# Altium schematic sheet RobotHead.SchDoc
size A4; SheetNumber: 1; SheetTotal: 1
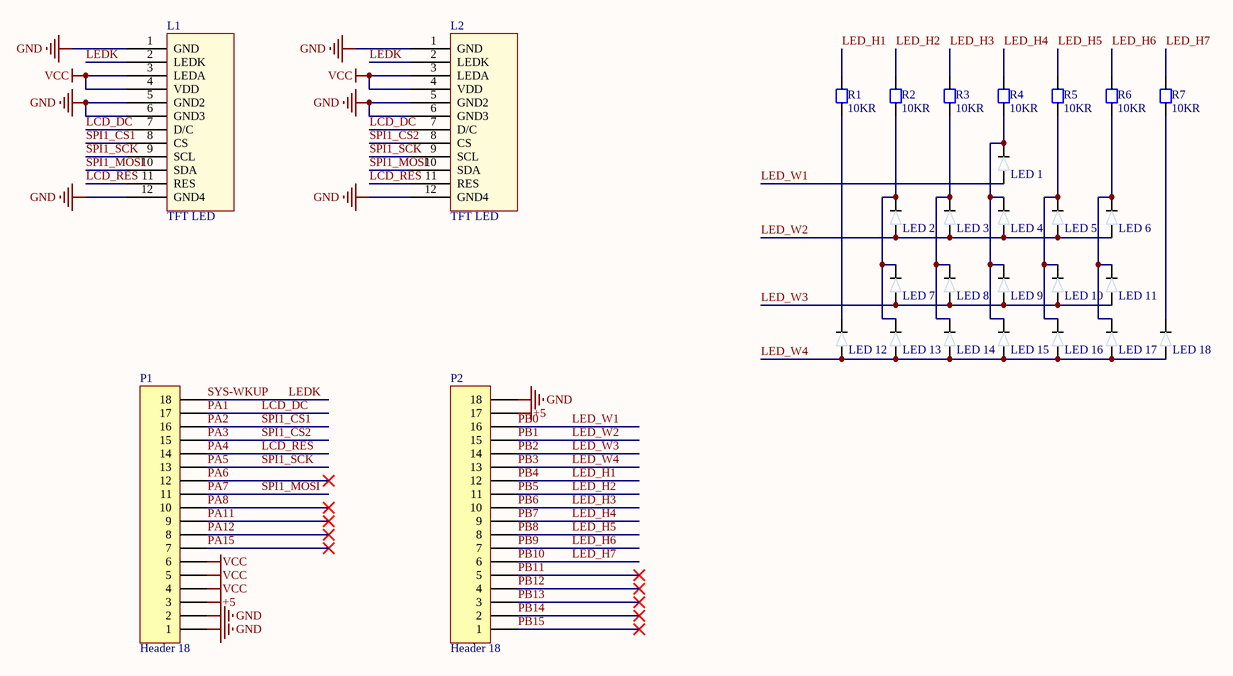
[diagram p0: RobotHead.SchDoc]

## Parts
L1  TFT LED  [LCD-1.28 IPS - (2)]
L2  TFT LED  [LCD-1.28 IPS - (2)]
LED_1  LED 0603  [LED 0603]  (value not drawn)
LED_2  LED 0603  [LED 0603]  (value not drawn)
LED_3  LED 0603  [LED 0603]  (value not drawn)
LED_4  LED 0603  [LED 0603]  (value not drawn)
LED_5  LED 0603  [LED 0603]  (value not drawn)
LED_6  LED 0603  [LED 0603]  (value not drawn)
LED_7  LED 0603  [LED 0603]  (value not drawn)
LED_8  LED 0603  [LED 0603]  (value not drawn)
LED_9  LED 0603  [LED 0603]  (value not drawn)
LED_10  LED 0603  [LED 0603]  (value not drawn)
LED_11  LED 0603  [LED 0603]  (value not drawn)
LED_12  LED 0603  [LED 0603]  (value not drawn)
LED_13  LED 0603  [LED 0603]  (value not drawn)
LED_14  LED 0603  [LED 0603]  (value not drawn)
LED_15  LED 0603  [LED 0603]  (value not drawn)
LED_16  LED 0603  [LED 0603]  (value not drawn)
LED_17  LED 0603  [LED 0603]  (value not drawn)
LED_18  LED 0603  [LED 0603]  (value not drawn)
P1  Header 18  [HDR1X18]
P2  Header 18  [HDR1X18]
R1  10KR  [CR1608-0603]
R2  10KR  [CR1608-0603]
R3  10KR  [CR1608-0603]
R4  10KR  [CR1608-0603]
R5  10KR  [CR1608-0603]
R6  10KR  [CR1608-0603]
R7  10KR  [CR1608-0603]

## Nets
+5: P1.3 P2.17
GND: L1.1(GND) L1.5(GND2) L1.6(GND3) L1.12(GND4) L2.1(GND) L2.5(GND2) L2.6(GND3) L2.12(GND4) P1.1 P1.2 P2.18
VCC: L1.3(LEDA) L1.4(VDD) L2.3(LEDA) L2.4(VDD) P1.4 P1.5 P1.6
LCD_DC: L1.7(D/C) L2.7(D/C) P1.17  [also labelled PA1]
LCD_RES: L1.11(RES) L2.11(RES) P1.14  [also labelled PA4]
LED_H1: P2.12 R1.2  [also labelled PB4]
LED_H2: P2.11 R2.2  [also labelled PB5]
LED_H3: P2.10 R3.2  [also labelled PB6]
LED_H4: P2.9 R4.2  [also labelled PB7]
LED_H5: P2.8 R5.2  [also labelled PB8]
LED_H6: P2.7 R6.2  [also labelled PB9]
LED_H7: P2.6 R7.2  [also labelled PB10]
LED_W1: LED_1.1 P2.16  [also labelled PB0]
LED_W2: LED_2.1 LED_3.1 LED_4.1 LED_5.1 LED_6.1 P2.15  [also labelled PB1]
LED_W3: LED_7.1 LED_8.1 LED_9.1 LED_10.1 LED_11.1 P2.14  [also labelled PB2]
LED_W4: LED_12.1 LED_13.1 LED_14.1 LED_15.1 LED_16.1 LED_17.1 LED_18.1 P2.13  [also labelled PB3]
LEDK: L1.2(LEDK) L2.2(LEDK) P1.18  [also labelled SYS-WKUP]
PA2: L1.8(CS) P1.16  [also labelled SPI1_CS1]
PA3: L2.8(CS) P1.15  [also labelled SPI1_CS2]
PA5: L1.9(SCL) L2.9(SCL) P1.13  [also labelled SPI1_SCK]
PA6: P1.12
PA7: L1.10(SDA) L2.10(SDA) P1.11  [also labelled SPI1_MOSI]
PA8: P1.10
PA11: P1.9
PA12: P1.8
PA15: P1.7
PB11: P2.5
PB12: P2.4
PB13: P2.3
PB14: P2.2
PB15: P2.1
NetLED_1_2: LED_1.2 LED_4.2 LED_9.2 LED_15.2 R4.1
NetLED_2_2: LED_2.2 LED_7.2 LED_13.2 R2.1
NetLED_3_2: LED_3.2 LED_8.2 LED_14.2 R3.1
NetLED_5_2: LED_5.2 LED_10.2 LED_16.2 R5.1
NetLED_6_2: LED_6.2 LED_11.2 LED_17.2 R6.1
NetLED_12_2: LED_12.2 R1.1
NetLED_18_2: LED_18.2 R7.1

## Library data of the parts
L1 L2 = LCD-IPSscreen-1.28: 1.28寸圆形LCD
P1 P2 = Header 18: Header, 18-Pin; LatestRevisionDate: 17-Jul-2002; LatestRevisionNote: Re-released for DXP Platform.; Publisher: Altium Limited
R1-R7 = Chip resistor: 贴片电阻